# EasyEDA Pro project MFU.eprj, schematic HUB_ESP
Board Name: HUB_ESP; Create Date: 2025-11-01; Page Name: P1; Project Name: MFU_V3_mainboard; Schematic Name: HUB_ESP; Update Date: 2026-01-14; Company: EasyEDA.com; Page Size: A4; Version: V1.0
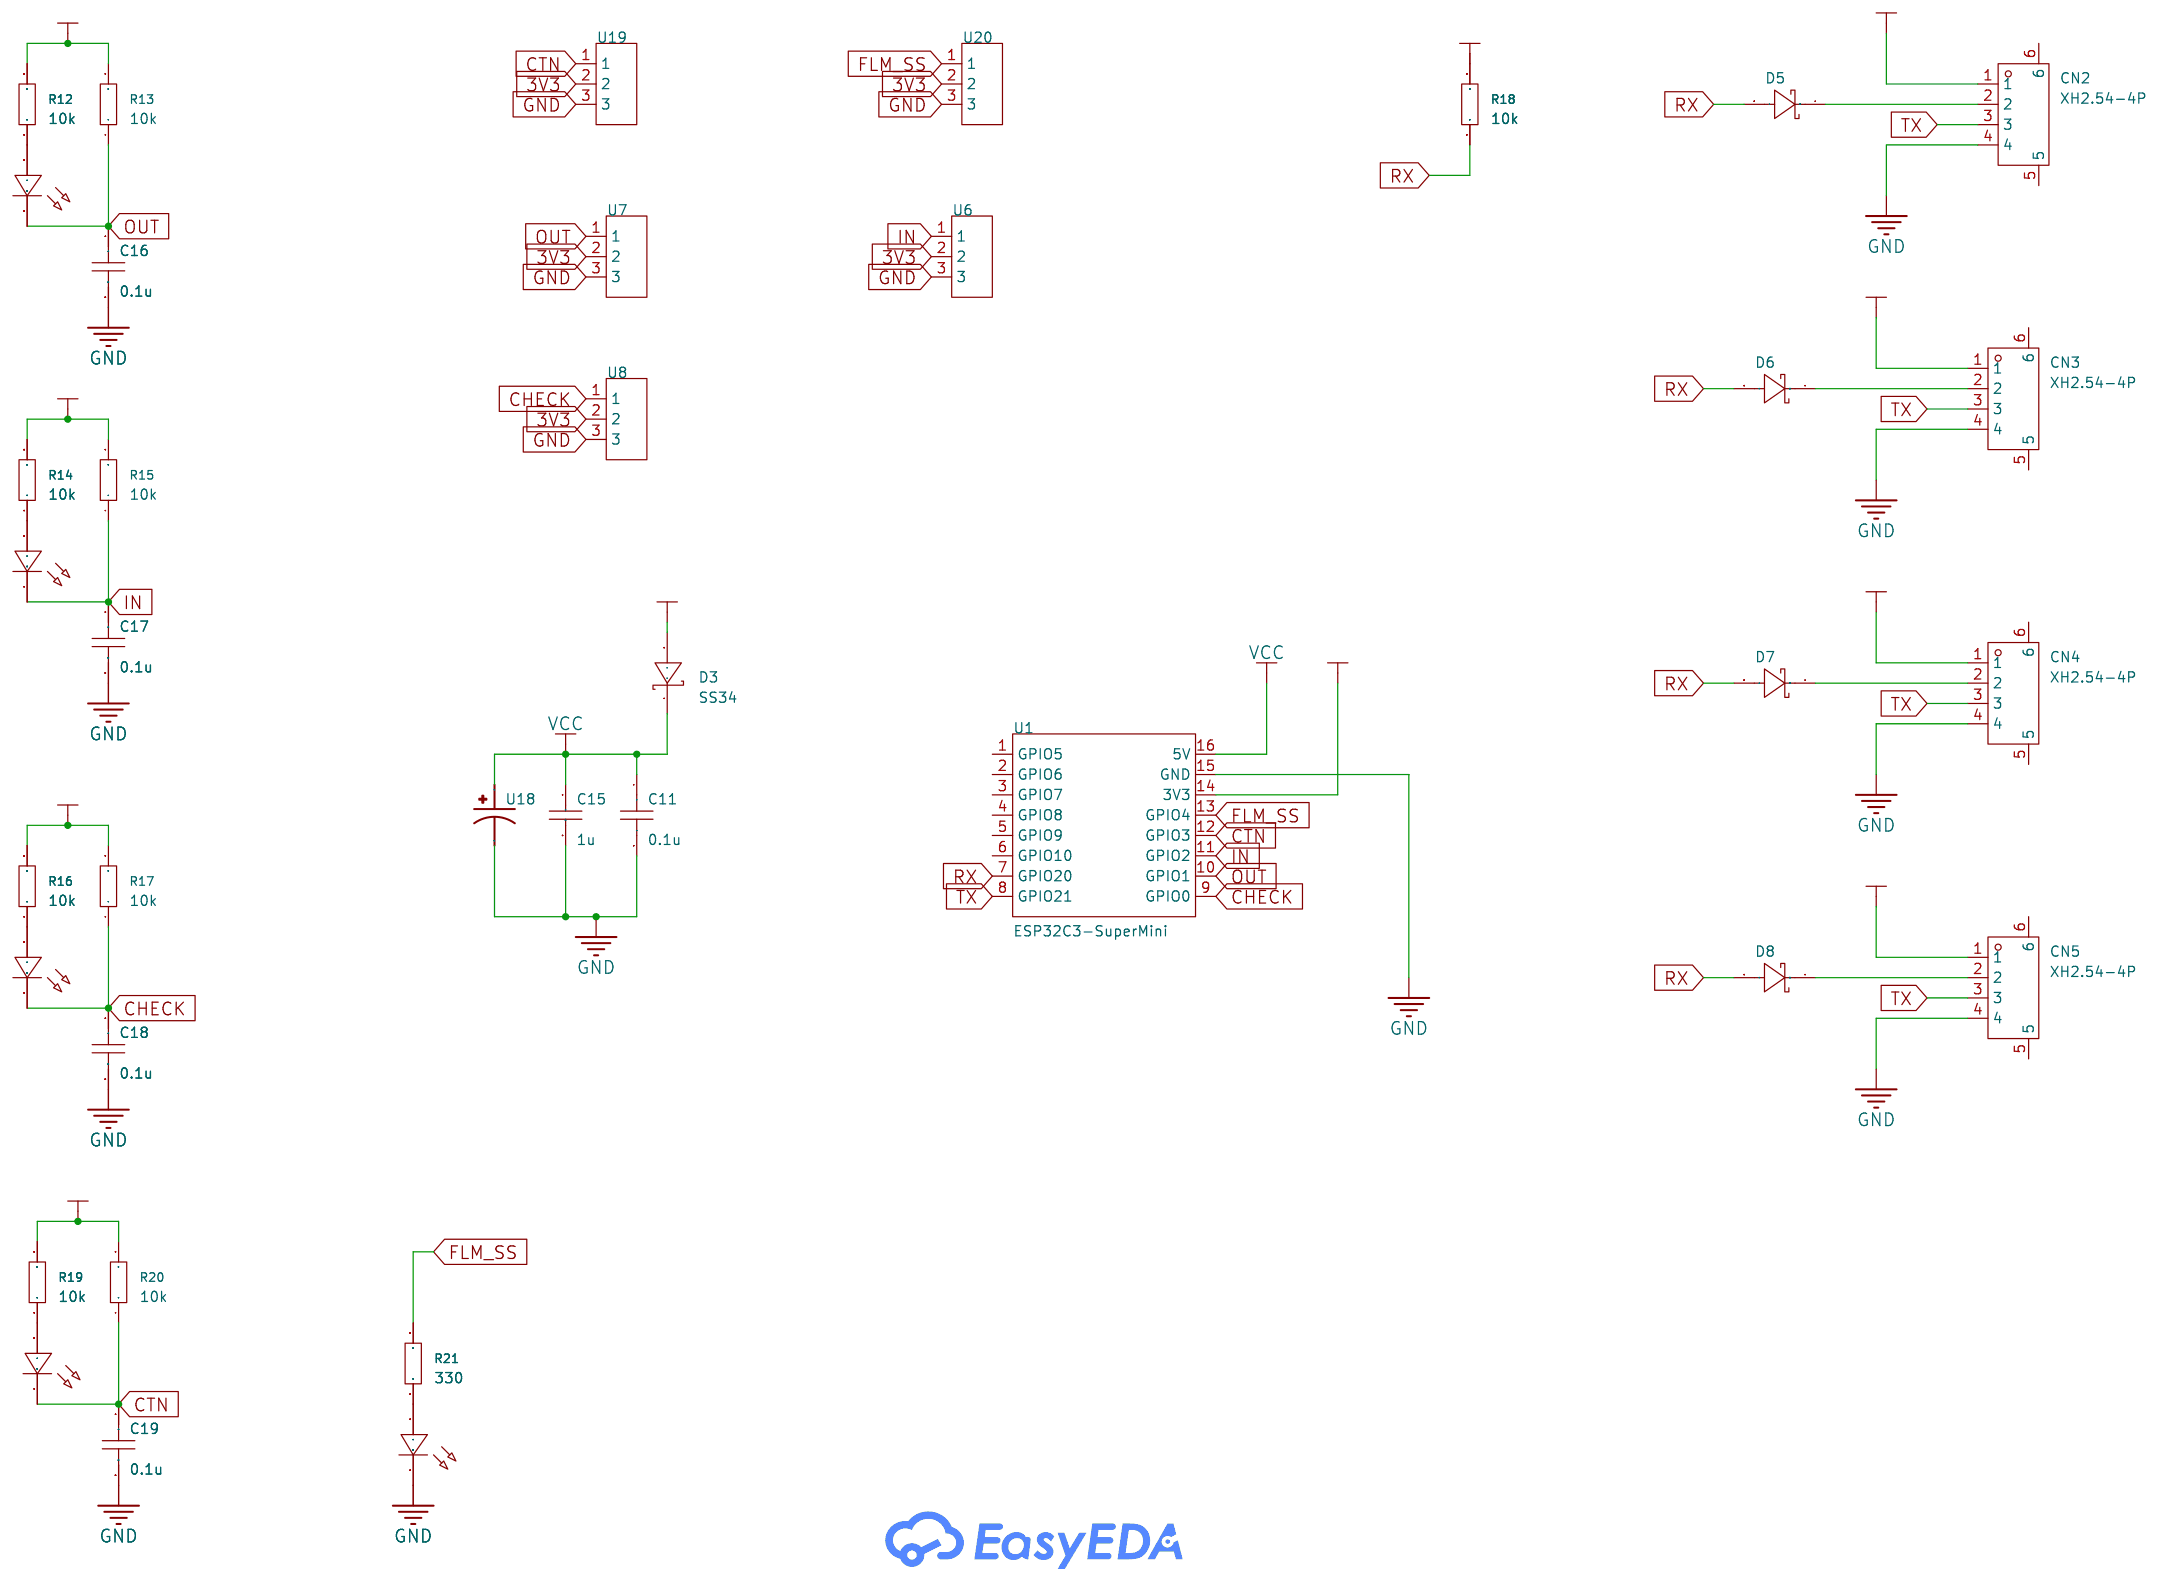
[diagram p2: schematic sheet]

## Parts
C11  0.1u  [C0805]
C15  1u  [C1206]
C16  0.1u  [C0805]
C17  0.1u  [C0805]
C18  0.1u  [C0805]
C19  0.1u  [C0805]
CN2  XH2.54-4P  [CONN-SMD_4P-P2.50-WT]
CN3  XH2.54-4P  [CONN-SMD_4P-P2.50-WT]
CN4  XH2.54-4P  [CONN-SMD_4P-P2.50-WT]
CN5  XH2.54-4P  [CONN-SMD_4P-P2.50-WT]
D3  SS34  [SMA_L4.4-W2.8-LS5.4-RD]
D5  BAT54GWJ-HXY  [SOD-123_L2.7-W1.6-LS3.7-RD]
D6  BAT54GWJ-HXY  [SOD-123_L2.7-W1.6-LS3.7-RD]
D7  BAT54GWJ-HXY  [SOD-123_L2.7-W1.6-LS3.7-RD]
D8  BAT54GWJ-HXY  [SOD-123_L2.7-W1.6-LS3.7-RD]
LED2  -  [LED0603-R-RD]
LED3  -  [LED0603-R-RD]
LED4  -  [LED0603-R-RD]
LED5  -  [LED0603-R-RD]
LED6  -  [LED0603-R-RD]
R12  10k  [R0805]
R13  10k  [R0805]
R14  10k  [R0805]
R15  10k  [R0805]
R16  10k  [R0805]
R17  10k  [R0805]
R18  10k  [R0805]
R19  10k  [R0805]
R20  10k  [R0805]
R21  330  [R0805]
U1  ESP32C3-SuperMini  [COMM-SMD_16P-L22.5-W18.0-P2.54-TL]
U6  电池端子3pin  [CONN-TH_3P-P1.25_C9900015739]
U7  电池端子3pin  [CONN-TH_3P-P1.25_C9900015739]
U8  电池端子3pin  [CONN-TH_3P-P1.25_C9900015739]
U18  TAJA106M010RNJ  [CAPMP3216X180N]
U19  电池端子3pin  [CONN-TH_3P-P1.25_C9900015739]
U20  电池端子3pin  [CONN-TH_3P-P1.25_C9900015739]

## Library data of the parts
C11 C16-C19 = CAP_0805: Supplier Footprint: 0805
C15 = CL31A107MQHNNNE: Capacitance:100uF Tolerance:±20% Tolerance:±20% Voltage Rating:6.3V Temperature Coefficient:X5R; LCSC Part Name: 100uF ±20% 6.3V; Supplier Part: C15008; Manufacturer: SAMSUNG(三星); Supplier Footprint: 1206; JLCPCB Part Class: Basic Part; Datasheet: https://item.szlcsc.com/datasheet/CL31A107MQHNNNE/15681.html; Supplier: LCSC; Tolerance: ±20%; Voltage Rating: 6.3V; Temperature Coefficient: X5R
CN2-CN5 = XH2.54-4P: Supplier Part: C9900004347; Supplier Footprint: XH2.54-3PSMD; JLCPCB Part Class: Extended Part; Supplier: LCSC
D3 = SS34: LCSC Part Name: 电压:40V 电流:3A; Supplier Part: C142458; Supplier Footprint: SMA(DO-214AC); JLCPCB Part Class: Extended Part; Datasheet: https://atta.szlcsc.com/upload/public/pdf/source/20171114/C142458_15106326937931117548.pdf; Supplier: LCSC; Forward Voltage (Vf@If): 500mV@3A; Reverse Voltage (Vr): 40V; Average Rectified Current (Io): 3A
D5-D8 = BAT54GWJ-HXY: Supplier Part: C52754565; Manufacturer: HXY MOSFET(华轩阳电子); Supplier Footprint: SOD-123; JLCPCB Part Class: Extended Part; Datasheet: https://item.szlcsc.com/datasheet/BAT54GWJ-HXY/55658096.html; Supplier: LCSC
LED2-LED6 = LED_0603-B: Supplier Footprint: 0603
R12-R21 = 0805W8F2001T5E: Type:Thick Film Resistors Resistance:2kΩ Tolerance:±1% Tolerance:±1% Power(Watts): Overload Voltage (Max): Temperature Coefficient:±100ppm/℃ Temperature Coefficient:±100ppm/℃ Operating Temperature Range:-55℃~+155℃ Operating Temperature Range:-55℃~+155℃; LCSC Part Name: 2kΩ ±1% 125mW 厚膜电阻; Supplier Part: C17604; Manufacturer: UNI-ROYAL(厚声); Supplier Footprint: 0805; JLCPCB Part Class: Basic Part; Datasheet: https://atta.szlcsc.com/upload/public/pdf/source/20200306/C422600_1E6D84923E4A46A82E41ADD87F860B5C.pdf; Supplier: LCSC; Type: Thick Film Resistors; Tolerance: ±1%; Temperature Coefficient: ±100ppm/℃; Operating Temperature Range: -55℃~+155℃
U1 = ESP32C3-SuperMini: Supplier Part: C9900147397; Supplier Footprint: SMD-16P; JLCPCB Part Class: Extended Part; Supplier: LCSC
U6-U8 U19 U20 = 电池端子3pin: Supplier Part: C9900015739; Supplier Footprint: 1.25mm-3pin直针; JLCPCB Part Class: Extended Part; Supplier: LCSC
U18 = TAJA106M010RNJ: 3216 smd capacitor

## Nets
3V3: R12.2 R13.2 R14.2 R15.2 R16.2 R17.2 R18.2 R19.2 R20.2 U1.14(3V3) U6.2 U7.2 U8.2 U19.2 U20.2
5V: CN2.1 CN3.1 CN4.1 CN5.1 D3.2(A)
GND: C11.2 C15.2 C16.2 C17.2 C18.2 C19.2 CN2.4 CN3.4 CN4.4 CN5.4 LED6.1(C) U1.15(GND) U6.3 U7.3 U8.3 U18.2 U19.3 U20.3
VCC: C11.1 C15.1 D3.1(K) U1.16(5V) U18.1
CHECK: C18.1 LED4.1(C) R17.1 U1.9(GPIO0) U8.1
CTN: C19.1 LED5.1(C) R20.1 U1.12(GPIO3) U19.1
FLM_SS: R21.2 U1.13(GPIO4) U20.1
IN: C17.1 LED3.1(C) R15.1 U1.11(GPIO2) U6.1
OUT: C16.1 LED2.1(C) R13.1 U1.10(GPIO1) U7.1
RX: D5.2(A) D6.2(A) D7.2(A) D8.2(A) R18.1 U1.7(GPIO20)
TX: CN2.3 CN3.3 CN4.3 CN5.3 U1.8(GPIO21)
$1N3011: LED2.2(A) R12.1
$1N3239: LED3.2(A) R14.1
$1N3371: LED4.2(A) R16.1
$1N4208: CN2.2 D5.1(C)
$1N4347: CN3.2 D6.1(C)
$1N4480: CN4.2 D7.1(C)
$1N4613: CN5.2 D8.1(C)
$1N5147: LED5.2(A) R19.1
$1N5311: LED6.2(A) R21.1

Not connected (* = marked no-connect by the designer): CN2 5 6; CN3 5 6; CN4 5 6; CN5 5 6; U1 1(GPIO5) 2(GPIO6) 3(GPIO7) 4(GPIO8) 5(GPIO9) 6(GPIO10)
